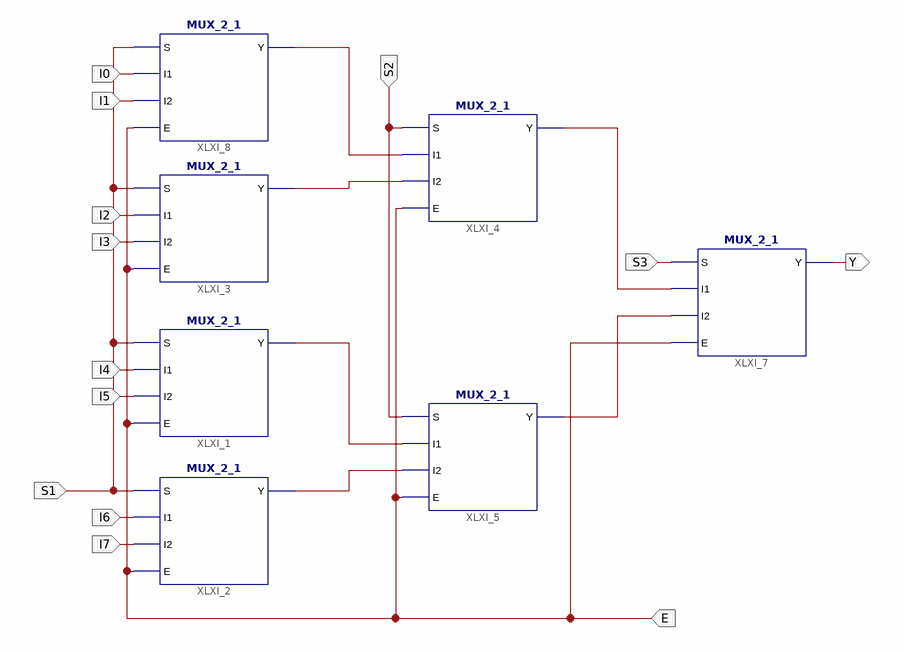
[diagram p0: schematic sheet 1]
// Xilinx ISE schematic MUX8_1.sch (artix7) as structural Verilog: 7 symbols, 13 ports
module MUX8_1 (
  input  E,
  input  S1,
  input  I0,
  input  S2,
  input  I1,
  input  I2,
  input  I3,
  input  I4,
  input  I5,
  input  I6,
  input  I7,
  input  S3,
  output Y
);

  wire XLXN_1, XLXN_2, XLXN_3, XLXN_4, XLXN_5, XLXN_6;

  MUX_2_1 XLXI_1 (.S(S1), .I1(I4), .I2(I5), .E(E), .Y(XLXN_3));
  MUX_2_1 XLXI_2 (.S(S1), .I1(I6), .I2(I7), .E(E), .Y(XLXN_4));
  MUX_2_1 XLXI_3 (.S(S1), .I1(I2), .I2(I3), .E(E), .Y(XLXN_2));
  MUX_2_1 XLXI_4 (.S(S2), .I1(XLXN_1), .I2(XLXN_2), .E(E), .Y(XLXN_5));
  MUX_2_1 XLXI_5 (.S(S2), .I1(XLXN_3), .I2(XLXN_4), .E(E), .Y(XLXN_6));
  MUX_2_1 XLXI_7 (.S(S3), .I1(XLXN_5), .I2(XLXN_6), .E(E), .Y(Y));
  MUX_2_1 XLXI_8 (.S(S1), .I1(I0), .I2(I1), .E(E), .Y(XLXN_1));
endmodule
